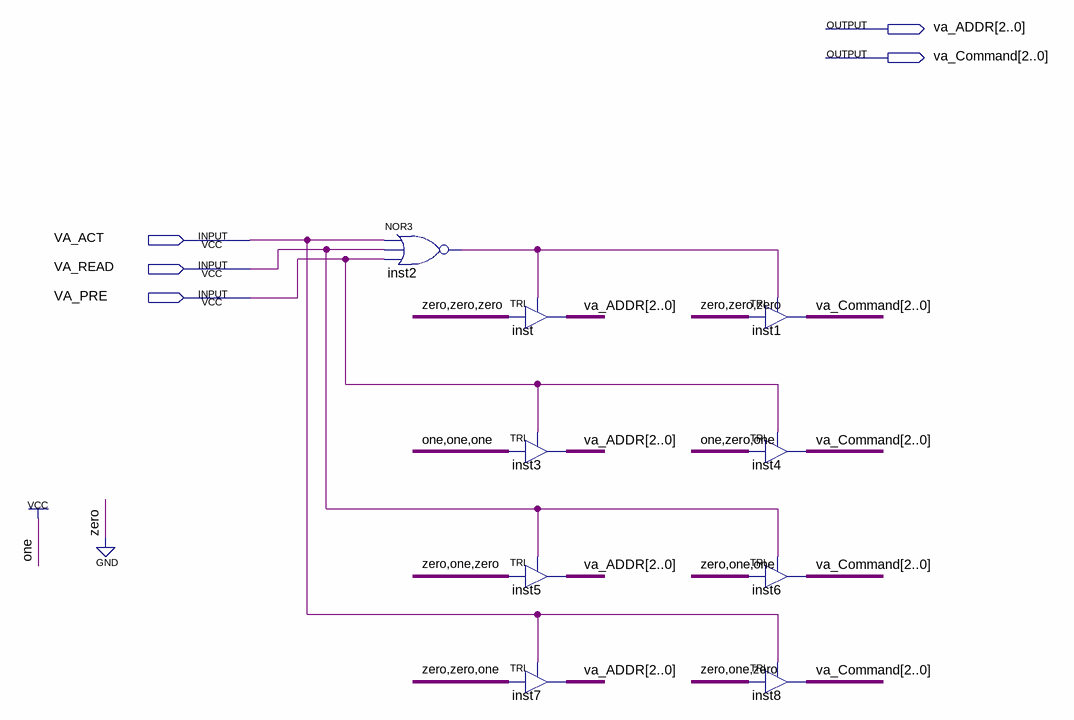
[diagram p0: schematic sheet]
// Quartus schematic VACommandGenerator.bdf as structural Verilog: 9 symbols, 5 pins
module VACommandGenerator (
  input  VA_ACT,
  input  VA_READ,
  input  VA_PRE,
  output [2:0] va_ADDR,
  output [2:0] va_Command
);

  wire inst2_out;

  nor inst2 (inst2_out, VA_ACT, VA_READ, VA_PRE);
  TRI inst[2:0] (.IN(3'b000), .OE(inst2_out), .OUT(va_ADDR));
  TRI inst3[2:0] (.IN(3'b111), .OE(VA_PRE), .OUT(va_ADDR));
  TRI inst5[2:0] (.IN(3'b010), .OE(VA_READ), .OUT(va_ADDR));
  TRI inst7[2:0] (.IN(3'b001), .OE(VA_ACT), .OUT(va_ADDR));
  TRI inst1[2:0] (.IN(3'b000), .OE(inst2_out), .OUT(va_Command));
  TRI inst4[2:0] (.IN(3'b101), .OE(VA_PRE), .OUT(va_Command));
  TRI inst6[2:0] (.IN(3'b011), .OE(VA_READ), .OUT(va_Command));
  TRI inst8[2:0] (.IN(3'b010), .OE(VA_ACT), .OUT(va_Command));
endmodule
